# EAGLE design v0.1 (EAGLE 7.6.0)
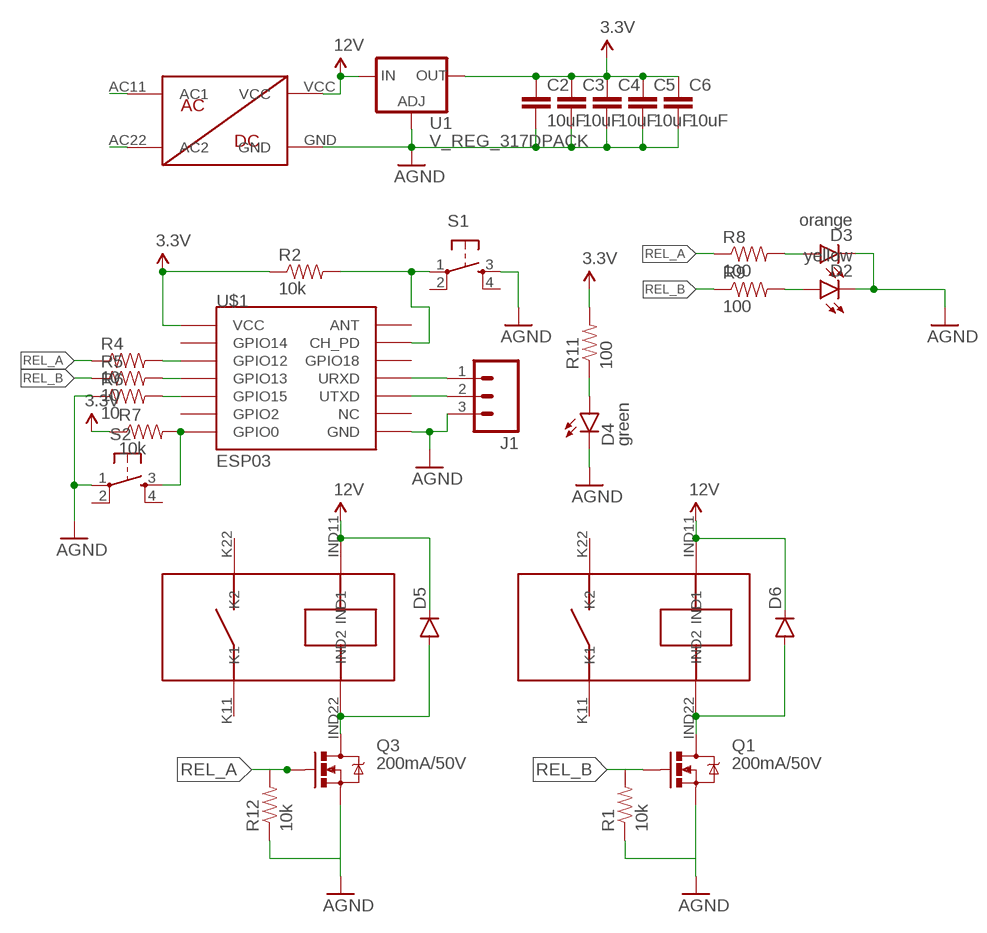
[diagram p0: schematic, sheet 1]

## Parts
C2  10uF  10UF-6.3V-20%(0603)  [0603-CAP]
C3  10uF  10UF-6.3V-20%(0603)  [0603-CAP]
C4  10uF  10UF-6.3V-20%(0603)  [0603-CAP]
C5  10uF  10UF-6.3V-20%(0603)  [0603-CAP]
C6  10uF  10UF-6.3V-20%(0603)  [0603-CAP]
D2  yellow  LED0603  [LED-0603]
D3  orange  LED0603  [LED-0603]
D4  green  LED0603  [LED-0603]
D5  DIODESOD123  [SOD-123]
D6  DIODESOD123  [SOD-123]
J1  M03LONGPADS  [1X03_LONGPADS]
Q1  200mA/50V  MOSFET-NCHANNELBSS138  [SOT23-3]
Q3  200mA/50V  MOSFET-NCHANNELBSS138  [SOT23-3]
R1  10k  RESISTOR0805-RES  [0805]
R2  10k  RESISTOR0805-RES  [0805]
R4  10  RESISTOR0805-RES  [0805]
R5  10  RESISTOR0805-RES  [0805]
R6  10  RESISTOR0805-RES  [0805]
R7  10k  RESISTOR0805-RES  [0805]
R8  100  RESISTOR0805-RES  [0805]
R9  100  RESISTOR0805-RES  [0805]
R11  100  RESISTOR0805-RES  [0805]
R12  10k  RESISTOR0805-RES  [0805]
S1  TAC_SWITCHPTH  [TACTILE-PTH]
S2  TAC_SWITCHPTH  [TACTILE-PTH]
U1  V_REG_317DPACK  [V-REG_DPACK]
U$1  ESP03  [ESP03]
U$8  ACDC12V350MA  [ACDC12V350MA]
U$9  302WP  [302WP]
U$10  302WP  [302WP]

## Nets
3.3V: C2.1 C3.1 C4.1 C5.1 C6.1 R2.1 R7.1 R11.2 U1.4(OUT) U$1.VCC
12V: D5.C D6.C U1.3(IN) U$8.VCC U$9.IND11(IND1) U$10.IND11(IND1)
AGND: C2.2 C3.2 C4.2 C5.2 C6.2 D2.C D3.C D4.C J1.3 Q1.2(S) Q3.2(S) R1.1 R6.1 R12.1 S1.3 S2.1 U1.1(ADJ) U$1.GND U$8.GND
N$1: J1.1 U$1.URXD
N$2: J1.2 U$1.UTXD
N$3: D5.A Q3.3(D) U$10.IND22(IND2)
N$4: R2.2 S1.1 U$1.CH_PD
N$5: U$8.AC11(AC1)
N$6: R4.2 U$1.GPIO12
N$7: R5.2 U$1.GPIO13
N$8: R6.2 U$1.GPIO15
N$9: D3.A R8.2
N$10: D2.A R9.2
N$11: U$8.AC22(AC2)
N$12: R7.2 S2.3 U$1.GPIO0
N$16: D4.A R11.1
N$17: D6.A Q1.3(D) U$9.IND22(IND2)
REL_A: Q3.1(G) R4.1 R8.1 R12.2
REL_B: Q1.1(G) R1.2 R5.1 R9.1
Unconnected: S1.2 S1.4 S2.2 S2.4 U$1.ANT U$1.GPIO2 U$1.GPIO14 U$1.GPIO18 U$1.NC U$9.K11(K1) U$9.K22(K2) U$10.K11(K1) U$10.K22(K2)

## Library data of the parts
C2-C6 = SparkFun-Capacitors:10UF-6.3V-20%(0603): CAP-11015; PROD_ID: CAP-11015
D2-D4 = SparkFun-LED:LED: LEDs Standard schematic elements and footprints for 5mm, 3mm, 1206, and 0603 sized LEDs. 5mm - Spark Fun Electronics SKU : COM-00529 (and others)
D5 D6 = SparkFun-DiscreteSemi:DIODE: Diode These are standard reverse protection diodes and small signal diodes. SMA package can handle up to about 1A. SOD-323 can handle about 200mA. What the SOD-323 package when ordering, there are some mfgs out there that are 5-pin packages.
J1 = SparkFun-Connectors:M03: Header 3 Standard 3-pin 0.1" header. Use with straight break away headers (SKU : PRT-00116), right angle break away headers (PRT-00553), swiss pins (PRT-00743), machine pins (PRT-00117), and female headers (PRT-00115). Molex polarized connector foot print use with SKU : PRT-08232 with associated crimp pins and housings.
Q1 Q3 = SparkFun-DiscreteSemi:MOSFET-NCHANNEL: Common NMOSFET Parts MFG P/N Store ID Prod ID FDD8780 TRANS-09984 SI7820DN TRANS-11055 FDS6630A IC-08089 2N7002PW TRANS-11151 FQP30N06L COM-10213 TRANS-10060 BSS123LT1G TRANS-08345 BSS138 TRANS-00830 BS170 2N7000; PROD_ID: TRANS-00830
R1 R2 R4-R9 R11 R12 = SparkFun-Passives:RESISTOR: Resistor Basic schematic elements and footprints for 0603, 1206, and PTH resistors.
S1 S2 = SparkFun-Retired:TAC_SWITCH: Momentary Switch Button commonly used for reset or general input. Spark Fun Electronics SKU : COM-00097 SMT- SWCH-08247
U1 = SparkFun-PowerIC:V_REG_317: Voltage Regulator Standard LM317 adjustable voltage regulator. AOI (Adjust Output Input). Google 'LM317 Calculator' for easy to use app to get the two resistor values needed. 240/720 for 5V output. 240/390 for 3.3V output. Spark Fun Electronics SKU : COM-00527; PROD_ID: IC-09888
U$1 = esp8266modules:ESP03: ESP8266 Wifi module 03; DIMENSIONS: 17.3 x 12.1 mm; PINS: 14; PITCH: 0.078" / 2 mm
U$8 = rel:ACDC12V350MA
U$9 U$10 = rel:302WP

## Board
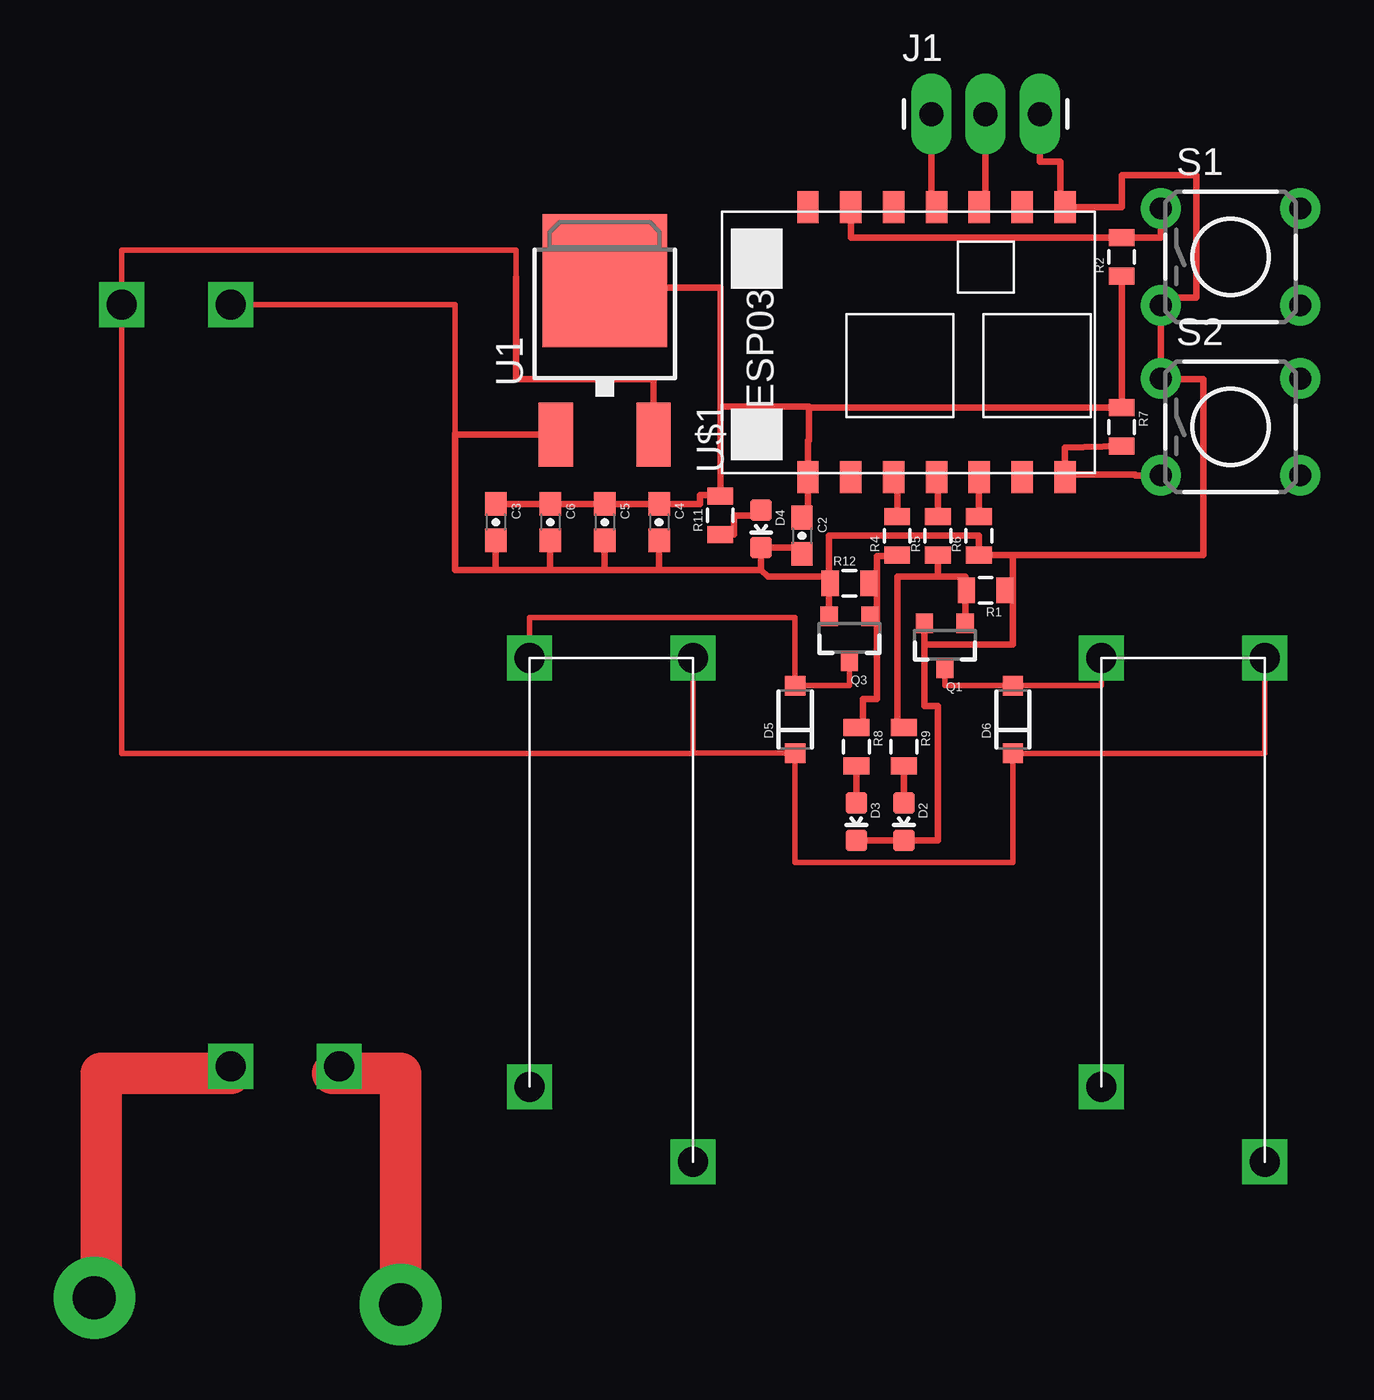
[diagram p1: board, top side]
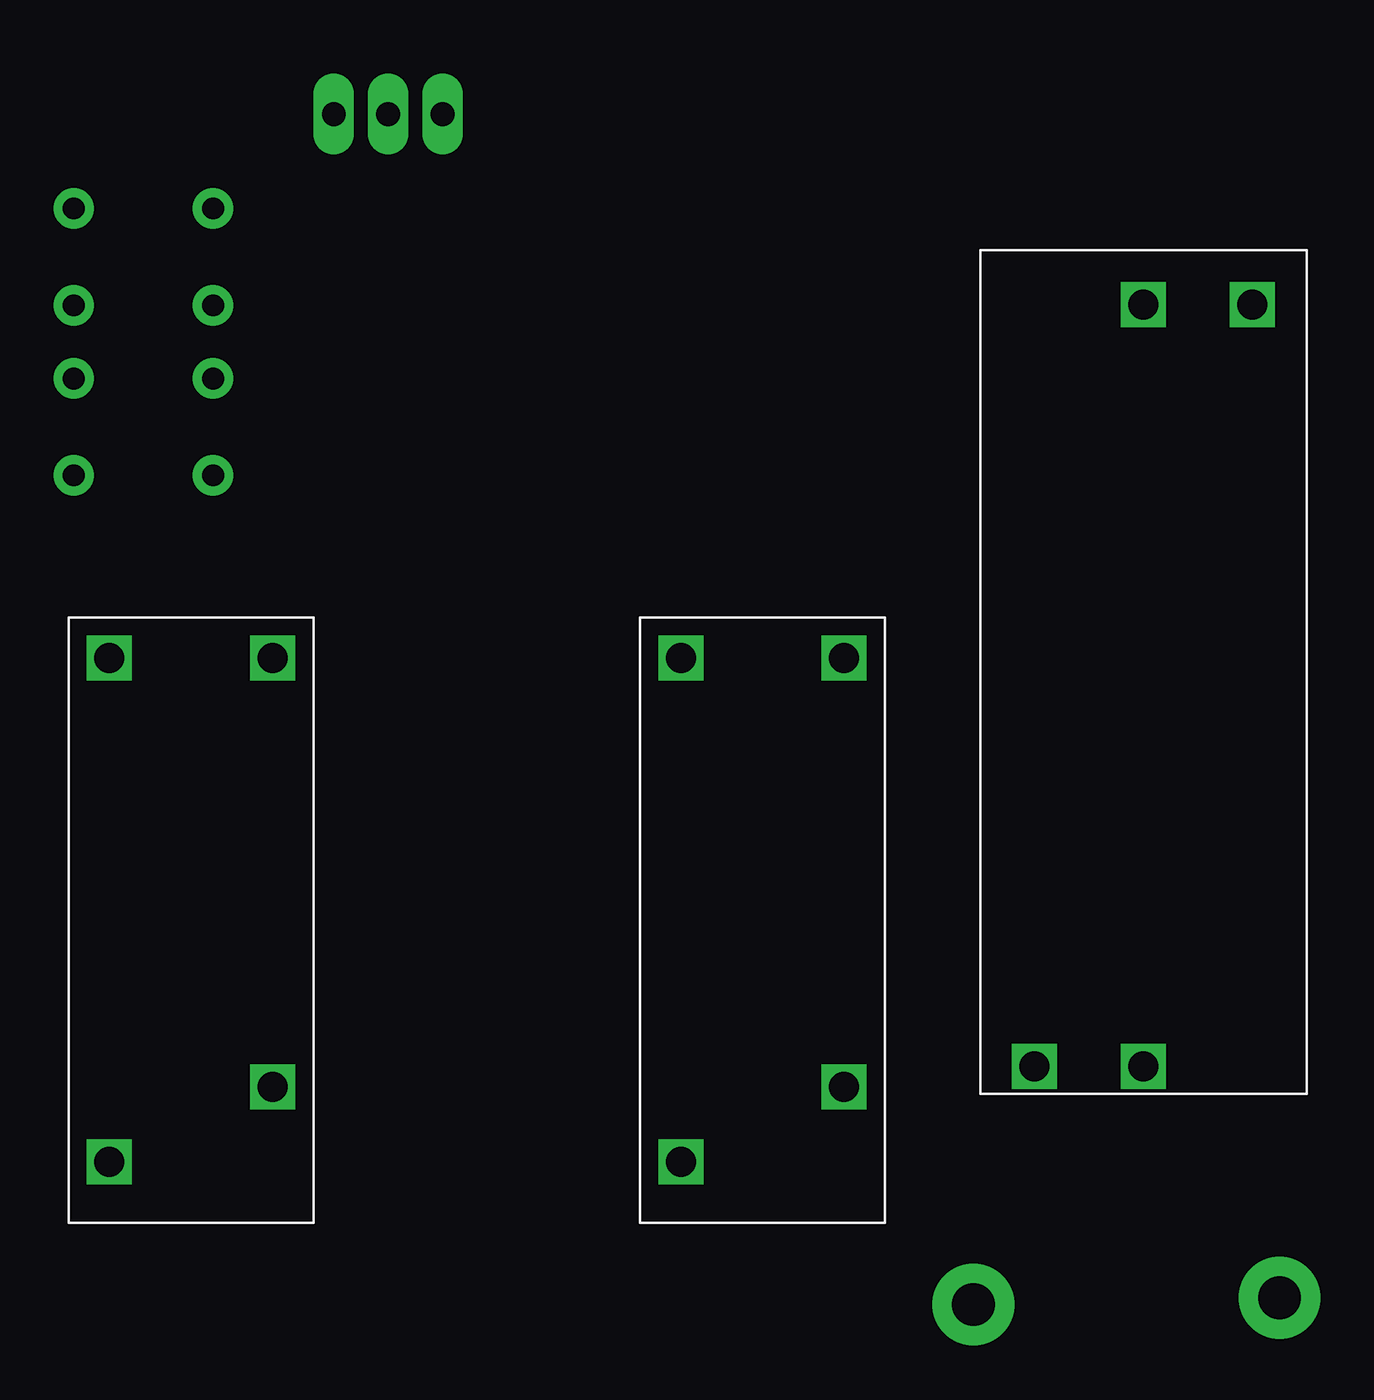
[diagram p2: board, bottom side, seen from below]

No outline drawn. Coordinates in mm, seen from the top.
Copper layers (1*16): Top 0.035mm / dielectric 1.5mm / Bottom 0.035mm
Design rules "default": minimum track width 10mil, minimum drill 24mil, track to track 8mil, track to pad 8mil, pad to pad 8mil, via to via 8mil, smd to smd 8mil, copper to edge 40mil, drill to drill 8mil, minimum pad ring 10mil, minimum via ring 8mil, stop-mask expansion 4mil, vias tented up to drill 0mil, thermal gap 10mil

### Footprints (pad centres in the part's own frame; a part is rotated, then mirrored left to right if it is on the bottom)
0603-CAP = smd 1.1 x 1: 1 -0.85,0; 2 0.85,0
LED-0603 = smd 1 x 1: A 0,-0.877; C 0,0.877
SOD-123 = smd 0.9 x 0.95: A 1.575,0; C -1.575,0
1X03_LONGPADS = drill 1.118 pad 1.88 long: 1 0,0; 2 2.54,0; 3 5.08,0
SOT23-3 = smd 0.8 x 0.9: 1 -0.95,-1; 2 0.95,-1; 3 0,1.1
0805 = smd 0.8 x 1.2: 1 -0.9,0; 2 0.9,0
TACTILE-PTH = drill 1.016 pad 1.88: 1 -3.251,2.261; 2 3.251,2.261; 3 -3.251,-2.261; 4 3.251,-2.261
V-REG_DPACK = smd 1.6 x 3: 1 -2.28,-4.8; 3 2.28,-4.8 | smd 5.8 x 6.2: 4 0,2.38
ESP03 = smd 1.5 x 1: ANT 7.4,4.8; CH_PD 7.4,2.8; GND 7.4,-7.2; GPIO0 -5.2,-7.2; GPIO2 -5.2,-5.2; GPIO12 -5.2,0.8; GPIO13 -5.2,-1.2; GPIO14 -5.2,2.8; GPIO15 -5.2,-3.2; GPIO18 7.4,0.8; NC 7.4,-5.2; URXD 7.4,-1.2; UTXD 7.4,-3.2; VCC -5.2,4.8
ACDC12V350MA = drill 1.4 square: AC11 1.27,12.7; AC22 1.27,7.62; GND 36.83,7.62; VCC 36.83,2.54
302WP = drill 1.4 square: IND11 1.905,1.905; IND22 1.905,9.525; K11 21.907,9.525; K22 25.4,1.905

### Placement (x,y rotation side)
C2  45.72,54.29 270 top
C3  31.43,54.93 270 top
C4  39.05,54.93 270 top
C5  36.51,54.93 270 top
C6  33.97,54.93 270 top
D2  50.48,40.96 180 top
D3  48.26,40.96 180 top
D4  43.81,54.61 180 top
D5  45.4,45.72 90 top
D6  55.56,45.72 90 top
J1  51.75,73.98 0 top
Q1  52.39,49.21 180 top
Q3  47.94,49.53 180 top
R1  54.29,51.75 180 top
R2  60.64,67.31 90 top
R4  50.16,54.29 90 top
R5  52.07,54.29 90 top
R6  53.98,54.29 90 top
R7  60.64,59.37 270 top
R8  48.26,44.45 270 top
R9  50.48,44.45 270 top
R11  41.91,55.24 90 top
R12  47.94,52.07 0 top
S1  65.72,67.31 0 top
S2  65.72,59.37 0 top
U1  36.51,63.82 0 top
U$1  50.8,62.23 90 top
U$8  11.43,28.26 90 bottom
U$9  69.22,50.48 270 bottom
U$10  42.55,50.48 270 bottom

### Tracks (layer width: path | path; a pad name or v marks a point on that pad's centre or on a via)
3.3V
  Top 0.305: 46.04,60.27 R7.1 R2.1 | 46.04,60.27 46.04,60.33 41.91,60.33 | 46.04,60.27 46.04,58.74 46,58.74 U$1.VCC 46,55.14 C2.1 | 41.91,60.33 R11.2 41.91,56.2 40.96,56.2 40.96,55.78 C4.1 C5.1 C6.1 C3.1 | 41.91,60.33 41.91,65.88 36.51,65.88 U1.4 36.51,66.67
12V
  Top 0.254: 32.38,66.36 32.38,67.63 13.97,67.63 13.97,64.45 13.97,44.13 40.64,44.13 40.64,44.15 | U$9.IND11 67.31,44.13 D6.C 55.56,39.05 45.4,39.05 D5.C 40.64,44.15 | 40.64,44.15 U$10.IND11
  Top 0.305: 32.38,66.36 32.38,61.59 38.79,61.59 U1.3
AGND
  Top 0.254: U$8.GND 29.53,65.09 29.53,59.02
  Top 0.305: 55.56,53.39 R6.1 53.98,54.29 46.99,54.29 46.99,52.39 | 55.56,53.39 64.45,53.39 64.45,61.59 62.47,61.59 S2.1 S1.3 62.47,65.41 64.14,65.41 64.14,71.12 60.64,71.12 60.64,69.63 U$1.GND 57.78,69.63 57.78,71.75 56.83,71.75 J1.3 | U1.1 29.53,59.02 | 29.53,59.02 29.53,52.7 31.43,52.7 | 31.43,52.7 33.97,52.7 | 33.97,52.7 36.51,52.7 | 36.51,52.7 39.05,52.7 | C3.2 31.43,52.7 | C6.2 33.97,52.7 | C5.2 36.51,52.7 | 29.53,59.05 29.53,59.02 | C4.2 39.05,52.7 | 39.05,52.7 43.81,52.7 | 43.81,52.7 D4.C 46.04,53.73 C2.2 | 46.99,52.39 44.13,52.39 43.81,52.7 | 51.44,49.21 55.56,49.21 55.56,51.75 | Q3.2 46.99,51.16 46.99,52.07 | 46.99,52.07 46.99,52.39 | R1.1 55.56,51.75 | 55.56,51.75 55.56,53.39 | 51.44,49.21 | 51.44,49.21 Q1.2 | R12.1 46.99,52.07 | D3.C D2.C 52.07,40.08 52.07,46.35 51.44,46.35 51.44,49.21
N$1
  Top 0.305: U$1.URXD 51.75,69.63 J1.1
N$2
  Top 0.305: U$1.UTXD 54.29,69.63 J1.2
N$3
  Top 0.254: Q3.3 47.94,47.3 D5.A 45.4,50.48 33.02,50.48 U$10.IND22
N$4
  Top 0.305: U$1.CH_PD | 47.89,69.63 U$1.CH_PD | U$1.CH_PD 48,68.21 R2.2 62.47,68.21 S1.1
N$6
  Top 0.305: U$1.GPIO12 50.16,57.03 R4.2
N$7
  Top 0.305: U$1.GPIO13 52.07,57.03 R5.2
N$8
  Top 0.305: U$1.GPIO15 53.98,57.03 R6.2
N$9
  Top 0.305: D3.A R8.2
N$10
  Top 0.305: D2.A R9.2
N$12
  Top 0.305: R7.2 58,58.42 U$1.GPIO0 58,57.15 61.28,57.15 61.28,57.11 S2.3
N$13
  Top 1.93: 19.05,29.21 13.02,29.21 13.02,18.73
N$14  (via drill 2 pad 3.81)
  other vias: 12.7,18.73
N$15  (via drill 2 pad 3.81)
  Top 1.93: 23.81,29.21 26.99,29.21 v26.99,18.41
N$16
  Top 0.305: R11.1 42.55,54.34 42.55,55.24 43.81,55.24 D4.A
N$17
  Top 0.254: U$9.IND22 59.69,47.3 D6.A 52.39,47.31 Q1.3
REL_A
  Top 0.305: 49.21,50.53 49.21,52.07 | 49.21,52.07 49.21,53.34 49.85,53.34 R4.1 | Q3.1 49.21,50.53 | 49.21,50.53 49.21,46.67 48.58,46.67 48.58,45.35 R8.1 | R12.2 49.21,52.07
REL_B
  Top 0.305: Q1.1 53.34,51.12 | 53.34,51.12 53.34,51.16 53.34,52.39 52.07,52.39 | 52.07,52.39 50.16,52.39 50.16,46.67 50.16,45.35 R9.1 | R5.1 52.07,52.39 | R1.2 53.34,51.75 53.34,51.12